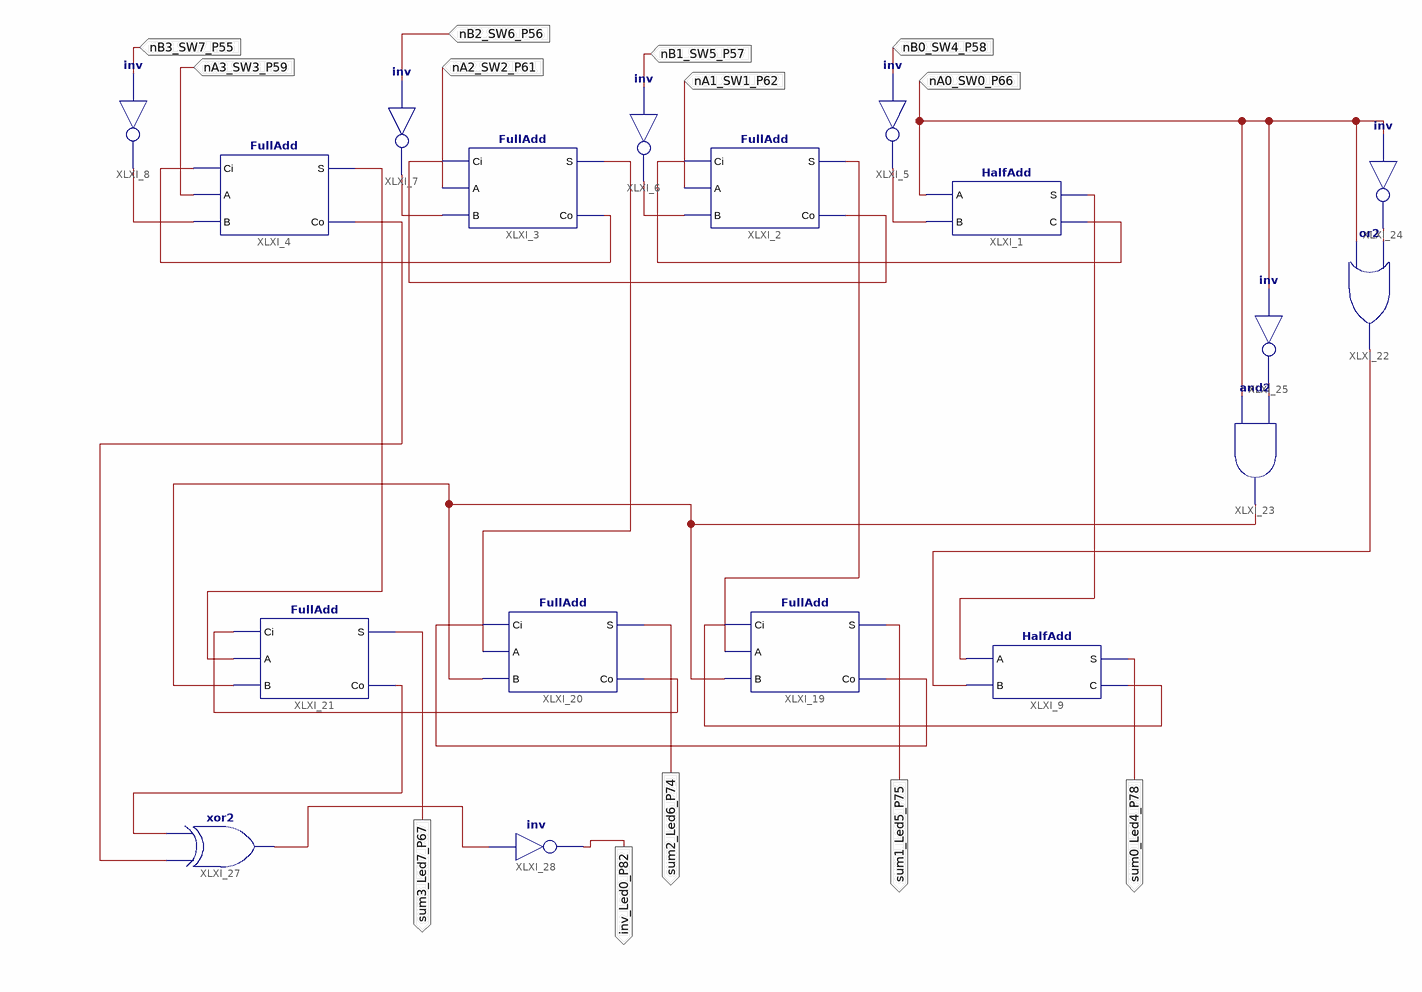
[diagram p0: schematic sheet 1]
// Xilinx ISE schematic Sub.sch (spartan6) as structural Verilog: 18 symbols, 13 ports
module Sub (
  input  nA0_SW0_P66,
  input  nA1_SW1_P62,
  input  nA2_SW2_P61,
  input  nB0_SW4_P58,
  input  nB1_SW5_P57,
  input  nB2_SW6_P56,
  input  nB3_SW7_P55,
  input  nA3_SW3_P59,
  output sum0_Led4_P78,
  output sum1_Led5_P75,
  output sum2_Led6_P74,
  output sum3_Led7_P67,
  output inv_Led0_P82
);

  wire s0_Led4_P78, s1_Led5_P75, s2_Led6_P74, XLXN_3, XLXN_8, XLXN_69, XLXN_74, XLXN_84, XLXN_89, XLXN_91,
       XLXN_92, XLXN_105, XLXN_106, XLXN_107, XLXN_108, XLXN_109, XLXN_110, XLXN_112, XLXN_115, XLXN_116,
       XLXN_121;

  HalfAdd XLXI_1 (.A(nA0_SW0_P66), .B(XLXN_109), .S(s0_Led4_P78), .C(XLXN_3));
  FullAdd XLXI_2 (.Ci(XLXN_3), .A(nA1_SW1_P62), .B(XLXN_108), .S(s1_Led5_P75), .Co(XLXN_8));
  FullAdd XLXI_3 (.Ci(XLXN_8), .A(nA2_SW2_P61), .B(XLXN_107), .S(s2_Led6_P74), .Co(XLXN_105));
  FullAdd XLXI_4 (.Ci(XLXN_105), .A(nA3_SW3_P59), .B(XLXN_106), .S(XLXN_115), .Co(XLXN_112));
  not XLXI_5 (XLXN_109, nB0_SW4_P58);
  not XLXI_6 (XLXN_108, nB1_SW5_P57);
  not XLXI_7 (XLXN_107, nB2_SW6_P56);
  not XLXI_8 (XLXN_106, nB3_SW7_P55);
  HalfAdd XLXI_9 (.A(s0_Led4_P78), .B(XLXN_92), .S(sum0_Led4_P78), .C(XLXN_69));
  FullAdd XLXI_19 (.Ci(XLXN_69), .A(s1_Led5_P75), .B(XLXN_84), .S(sum1_Led5_P75), .Co(XLXN_74));
  FullAdd XLXI_20 (.Ci(XLXN_74), .A(s2_Led6_P74), .B(XLXN_84), .S(sum2_Led6_P74), .Co(XLXN_116));
  FullAdd XLXI_21 (.Ci(XLXN_116), .A(XLXN_115), .B(XLXN_84), .S(sum3_Led7_P67), .Co(XLXN_110));
  or XLXI_22 (XLXN_92, nA0_SW0_P66, XLXN_89);
  not XLXI_24 (XLXN_89, nA0_SW0_P66);
  and XLXI_23 (XLXN_84, nA0_SW0_P66, XLXN_91);
  not XLXI_25 (XLXN_91, nA0_SW0_P66);
  xor XLXI_27 (XLXN_121, XLXN_112, XLXN_110);
  not XLXI_28 (inv_Led0_P82, XLXN_121);
endmodule
